# EAGLE design OpenVSD (EAGLE 6.5.0)
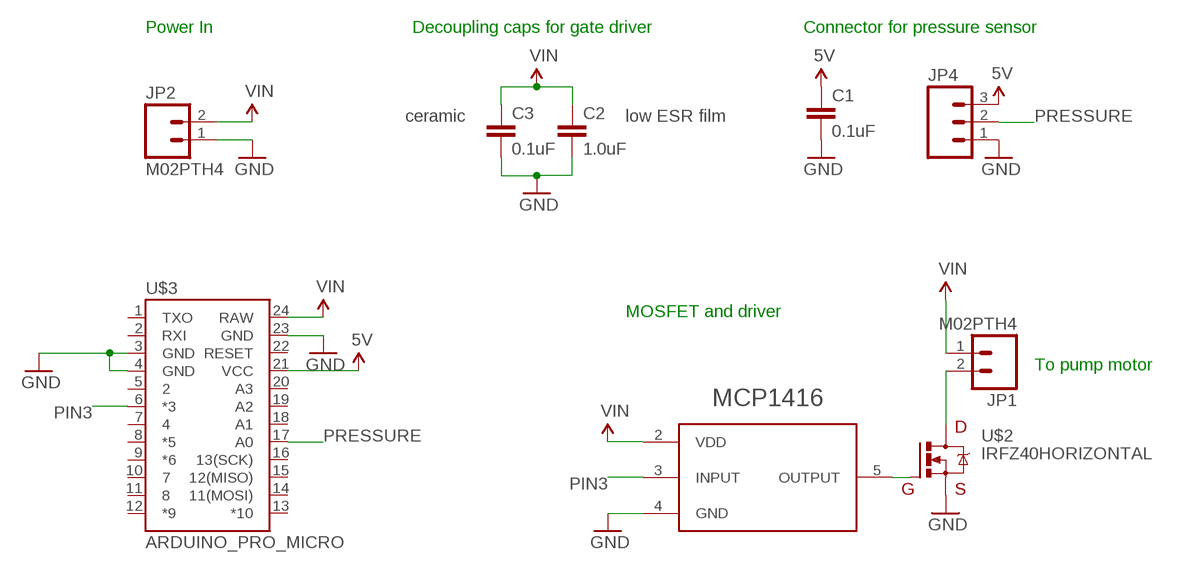
[diagram p0: schematic, sheet 1]

## Parts
C1  0.1uF  0.1UF-100V-10%(0603)  [0603-CAP]
C2  1.0uF  1.0UF-16V-10%(0603)  [0603-CAP]
C3  0.1uF  0.1UF-100V-10%(0603)  [0603-CAP]
JP1  M02PTH4  [1X02_XTRA_BIG]
JP2  M02PTH4  [1X02_XTRA_BIG]
JP4  M03PTH  [1X03]
U$1  MCP1416  [SOT23-5]
U$2  IRFZ40HORIZONTAL  [TO220]
U$3  ARDUINO_PRO_MICRO  [ARDUINO_PRO_MICRO]

## Nets
5V: C1.1 JP4.3 U$3.21(VCC)
GND: C1.2 C2.2 C3.2 JP2.1 JP4.1 U$1.4(GND) U$2.3(S) U$3.3(GND) U$3.4(GND) U$3.23(GND)
N$2: U$1.5(OUTPUT) U$2.1(G)
PIN3: U$1.3(INPUT) U$3.6(*3)
PRESSURE: JP4.2 U$3.17(A0)
PUMP-: JP1.2 U$2.2(D)
VIN: C2.1 C3.1 JP1.1 JP2.2 U$1.2(VDD) U$3.24(RAW)
Unconnected: U$3.1(TXO) U$3.2(RXI) U$3.5 U$3.7 U$3.8(*5) U$3.9(*6) U$3.10 U$3.11 U$3.12(*9) U$3.13(*10) U$3.14(11(MOSI)) U$3.15(12(MISO)) U$3.16(13(SCK)) U$3.18(A1) U$3.19(A2) U$3.20(A3) U$3.22(RESET)

## Notes on the sheet
- Power In | Decoupling caps for gate driver | Connector for pressure sensor
- ceramic | low ESR film
- MOSFET and driver
- To pump motor

## Library data of the parts
C1 C3 = SparkFun-Capacitors:0.1UF-100V-10%(0603): CAP-08390; PROD_ID: CAP-08390
C2 = SparkFun-Capacitors:1.0UF-16V-10%(0603): CAP-00868; PROD_ID: CAP-00868
JP1 JP2 = SparkFun-Connectors:M02: Standard 2-pin 0.1" header. Use with - straight break away headers ( PRT-00116) - right angle break away headers (PRT-00553) - swiss pins (PRT-00743) - machine pins (PRT-00117) - female headers (PRT-00115) Molex polarized connector foot print use with: PRT-08233 with associated crimp pins and housings. 2.54_SCREWTERM for use with PRT-10571. 3.5mm Screw Terminal footprints for PRT-08084 5mm Screw Terminal footprints for use with PRT-08433
JP4 = SparkFun-Connectors:M03: Header 3 Standard 3-pin 0.1" header. Use with straight break away headers (SKU : PRT-00116), right angle break away headers (PRT-00553), swiss pins (PRT-00743), machine pins (PRT-00117), and female headers (PRT-00115). Molex polarized connector foot print use with SKU : PRT-08232 with associated crimp pins and housings.
U$1 = Johnboiles:MCP1416
U$2 = Johnboiles:IRFZ40
U$3 = SparkFun-Boards:ARDUINO_PRO_MICRO

## Board
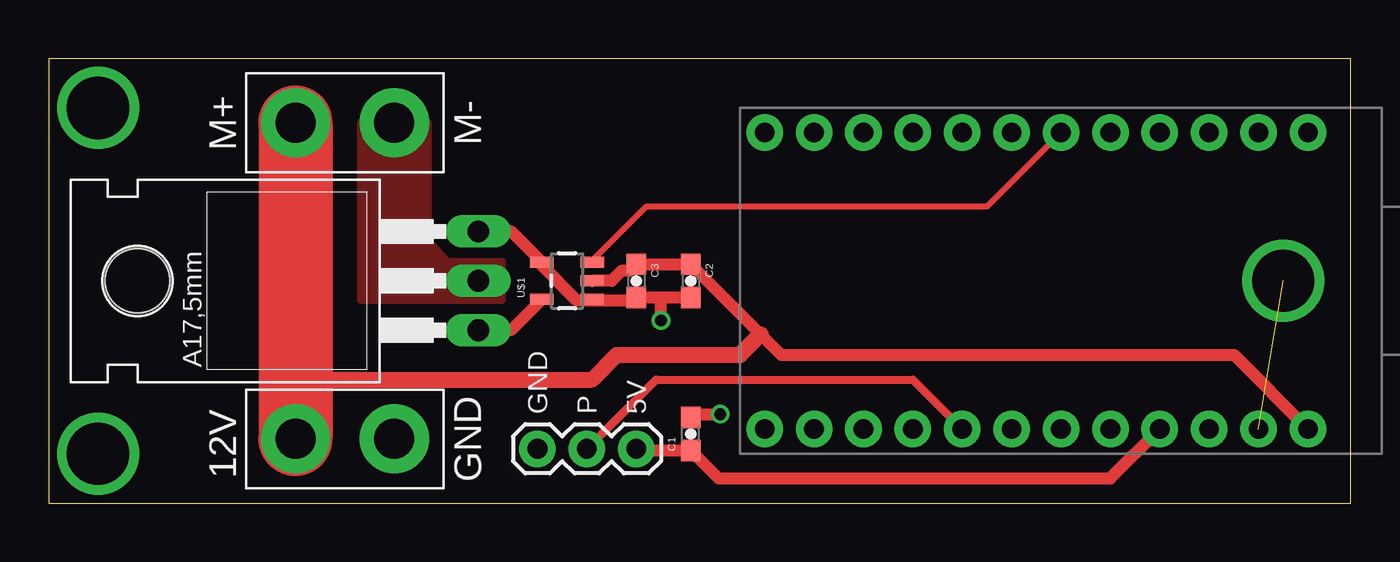
[diagram p1: board, top side]
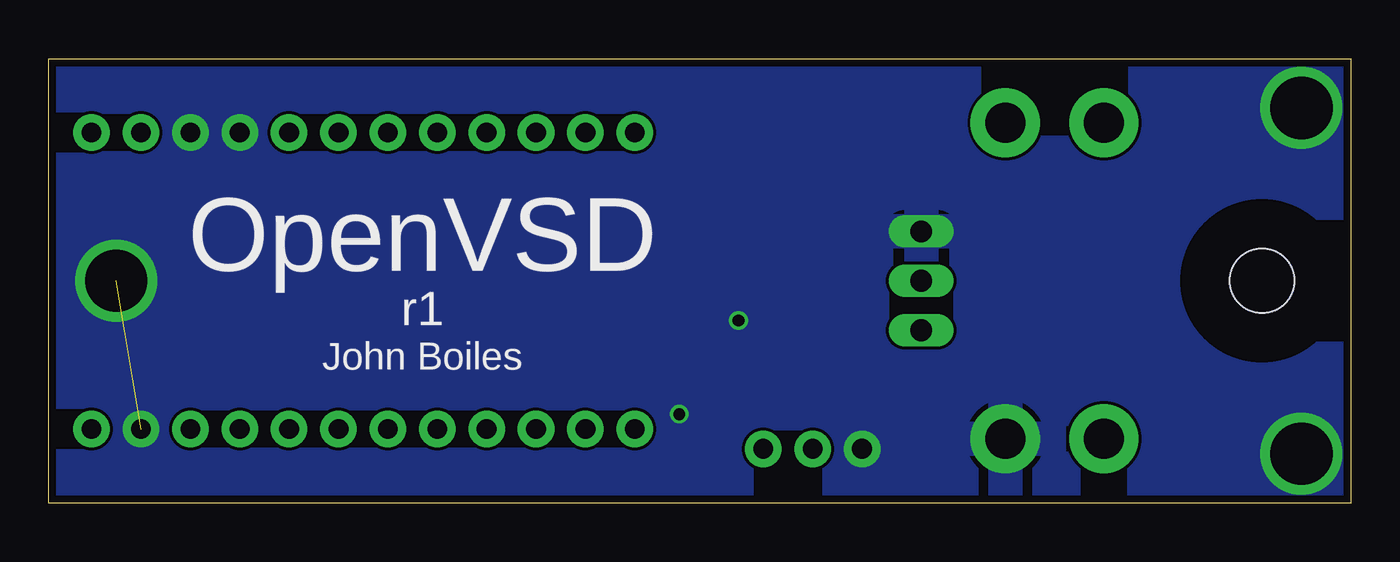
[diagram p2: board, bottom side, seen from below]

Size 66.98 x 22.85 mm. Coordinates in mm from the lower left corner, seen from the top.
Outline: 0,0 66.98,0 66.98,22.85 0,22.85 0,0
Copper layers (1*16): Top 0.0356mm / dielectric 1.5011mm / Bottom 0.0356mm
Design rules "OshPark": minimum track width 6mil, minimum drill 13mil, track to track 6mil, track to pad 6mil, pad to pad 6mil, via to via 6mil, smd to smd 6mil, copper to edge 15mil, drill to drill 6mil, minimum pad ring 7mil, minimum via ring 7mil, stop-mask expansion 3mil, vias tented up to drill 0mil, thermal gap 10mil

### Footprints (pad centres in the part's own frame; a part is rotated, then mirrored left to right if it is on the bottom)
0603-CAP = smd 1.1 x 1: 1 -0.85,0; 2 0.85,0
1X02_XTRA_BIG = drill 2.057 pad 3.556: 1 -2.54,0; 2 2.54,0
1X03 = drill 1.016 pad 1.88: 1 0,0; 2 2.54,0; 3 5.08,0
SOT23-5 = smd 0.55 x 1.2: 1 -0.95,-1.3; 2 0,-1.3; 3 0.95,-1.3; 4 0.95,1.3; 5 -0.95,1.3
TO220 = drill 1.118 long: 1 -2.54,-6.35; 2 0,-6.35; 3 2.54,-6.35 | hole 3.302: 0,11.176
ARDUINO_PRO_MICRO = drill 1.016 pad 1.88: 1 -7.62,12.7; 2 -7.62,10.16; 3 -7.62,7.62; 4 -7.62,5.08; 5 -7.62,2.54; 6 -7.62,0; 7 -7.62,-2.54; 8 -7.62,-5.08; 9 -7.62,-7.62; 10 -7.62,-10.16; 11 -7.62,-12.7; 12 -7.62,-15.24; 13 7.62,-15.24; 14 7.62,-12.7; 15 7.62,-10.16; 16 7.62,-7.62; 17 7.62,-5.08; 18 7.62,-2.54; 19 7.62,0; 20 7.62,2.54; 21 7.62,5.08; 22 7.62,7.62; 23 7.62,10.16; 24 7.62,12.7

### Placement (x,y rotation side)
C1  33.02,3.56 90 top
C2  33.02,11.43 270 top
C3  30.23,11.43 270 top
JP1  15.24,19.56 0 top
JP2  15.24,3.3 180 top
JP4  25.15,2.79 0 top
U$1  26.67,11.43 90 top
U$2  15.75,11.43 90 top
U$3  52.07,11.43 270 top

### Tracks (layer width: path | path; a pad name or v marks a point on that pad's centre or on a via)
5V
  Top 0.61: JP4.3 30.31,2.71 C1.1 34.46,1.27 54.61,1.27 U$3.21
GND  (via drill 0.6, 3.2 pad 3.81)  (1 unrouted)
  Top 0.61: U$2.3 23.78,13.97 U$1.4 25.37,12.22 27.18,10.41 30.06,10.41 C3.2 C2.2 | v31.5,9.4 31.5,10.41 | C1.2 33.19,4.57 v34.54,4.57
  other vias: 2.54,20.32 2.54,2.54 63.5,11.43
  pour Bottom: 0,0 0,22.86 67.31,22.86 67.31,0
N$2
  Top 0.61: U$1.5 23.78,8.89 U$2.1
PIN3
  Top 0.305: U$3.6 48.26,15.24 30.73,15.24 27.97,12.48 U$1.3
PRESSURE
  Top 0.406: JP4.2 31.24,6.35 44.45,6.35 U$3.17
PUMP-
  pour Top (no thermals): 16,19.56 16,10.41 23.37,10.41 23.37,12.45 20.57,12.45 19.56,13.46 19.56,19.56
VIN
  Top 0.61: U$1.2 28.96,11.43 29.46,11.94 29.88,11.94 C3.1 C2.1 36.62,8.68 37.68,7.62 60.96,7.62 U$3.24
  Top 0.813: JP2.2 12.7,6.35 27.94,6.35 29.21,7.62 35.56,7.62 36.62,8.68
  Top 3.81: JP1.1 JP2.2

### Text on the board
tNames: M+ | M- | GND | P | 5V | 12V | GND
bNames: OpenVSD | r1 | John Boiles